# EAGLE design tx35 (EAGLE 6.5.0)
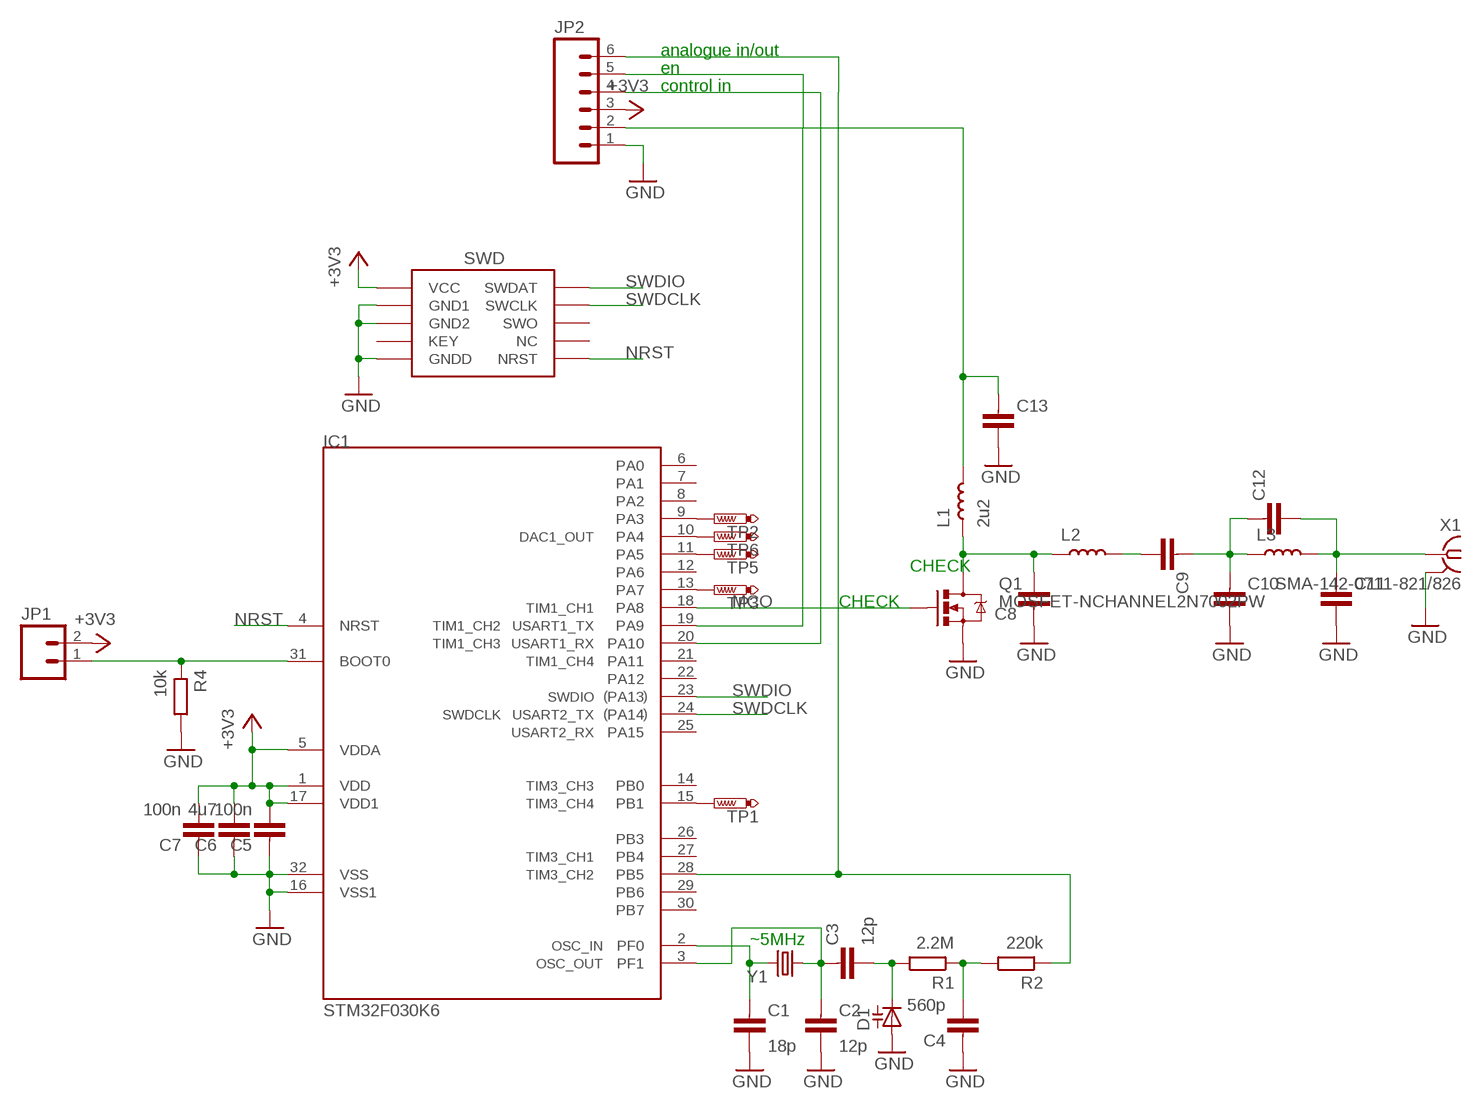
[diagram p0: schematic, sheet 1]

## Parts
C1  18p  CAPACITOR0603-N  [C0603-N]
C2  12p  CAPACITOR0603-N  [C0603-N]
C3  12p  CAPACITOR0603-N  [C0603-N]
C4  560p  CAPACITOR0603-N  [C0603-N]
C5  100n  CAPACITOR0603-N  [C0603-N]
C6  4u7  CAPACITOR0603-N  [C0603-N]
C7  100n  CAPACITOR0603-N  [C0603-N]
C8  CAPACITOR0603-N  [C0603-N]
C9  CAPACITOR0603-N  [C0603-N]
C10  CAPACITOR0603-N  [C0603-N]
C11  CAPACITOR0603-N  [C0603-N]
C12  CAPACITOR0603-N  [C0603-N]
C13  CAPACITOR0805-N  [C0805-N]
D1  DIODE_CAPACITANCE-SOD523  [SOD523]
IC1  STM32F030K6  STM32F0-32  [TQFP32-08]
J1  SWD_SHROUD  [SWD_PTH_SHROUD]
JP1  M02PTH  [1X02]
JP2  M06SILK_FEMALE_PTH  [1X06]
L1  2u2  INDUCTOR0603-N  [L0603-N]
L2  INDUCTOR0603-N  [L0603-N]
L3  INDUCTOR0603-N  [L0603-N]
Q1  MOSFET-NCHANNEL2N7002PW  [SOT323]
R1  2.2M  RESISTOR0603-N  [R0603-N]
R2  220k  RESISTOR0603-N  [R0603-N]
R4  10k  RESISTOR0603-N  [R0603-N]
TP1  PTR1TP11R  [TP11R]
TP2  PTR1TP11R  [TP11R]
TP3  PTR1TP11R  [TP11R]
TP5  PTR1TP11R  [TP11R]
TP6  PTR1TP11R  [TP11R]
X1  SMA-142-0711-821/826  [J502-ND-142-0711-821/826]
Y1  CRYSTALHC49UV  [HC49U-V]

## Nets
+3V3: C5.2 C6.2 C7.2 IC1.1(VDD) IC1.5(VDDA) IC1.17(VDD1) J1.1(VCC) JP1.2 JP2.3
GND: C1.2 C2.2 C4.1 C5.1 C6.1 C7.1 C8.1 C10.2 C11.2 C13.2 D1.A IC1.16(VSS1) IC1.32(VSS) J1.3(GND1) J1.5(GND2) J1.9(GNDD) JP2.1 Q1.2(S) R4.2 X1.G@1 X1.G@2 X1.G@3 X1.G@4
MCO: IC1.18(PA8) Q1.1(G)
N$1: C2.1 C3.1 IC1.3(PF1) Y1.1
N$2: C1.1 IC1.2(PF0) Y1.2
N$3: C3.2 D1.C R1.2
N$4: C4.2 R1.1 R2.2
N$5: IC1.28(PB5) JP2.6 R2.1
N$6: C11.1 C12.2 L3.2 X1.1
N$7: C13.1 JP2.2 L1.2
N$8: C9.1 C10.1 C12.1 L3.1
N$9: IC1.20(PA10) JP2.4
N$10: C9.2 L2.2
N$11: C8.2 L1.1 L2.1 Q1.3(D)
N$12: IC1.19(PA9) JP2.5
N$13: IC1.31(BOOT0) JP1.1 R4.1
N$14: IC1.9(PA3) TP2.TP
N$15: IC1.15(PB1) TP1.TP
N$16: IC1.13(PA7) TP3.TP
N$18: IC1.11(PA5) TP5.TP
N$19: IC1.10(PA4) TP6.TP
NRST: IC1.4(NRST) J1.10(NRST)
SWDCLK: IC1.24(PA14) J1.4(SWCLK)
SWDIO: IC1.23(PA13) J1.2(SWDAT)
Unconnected: IC1.6(PA0) IC1.7(PA1) IC1.8(PA2) IC1.12(PA6) IC1.14(PB0) IC1.21(PA11) IC1.22(PA12) IC1.25(PA15) IC1.26(PB3) IC1.27(PB4) IC1.29(PB6) IC1.30(PB7) J1.6(SWO) J1.7(KEY) J1.8(NC)

## Notes on the sheet
- analogue in/out
- en
- control in
- CHECK
- CHECK
- ~5MHz

## Library data of the parts
C1-C7 C9-C13 = passives-7351:CAPACITOR
C8 = passives-7351:CAPACITOR; FARNELL: 2434613/2435457
D1 = diode:DIODE_CAPACITANCE-: Capacity DIODE; FARNELL: 1757783/(2443453)
IC1 = Mine:STM32F0-32; FARNELL: 2432085
J1 = dtb:SWD_SHROUD
JP1 = Mine:M02: Header 2 Standard 2-pin 0.1" header. Use with straight break away headers (SKU : PRT-00116), right angle break away headers (PRT-00553), swiss pins (PRT-00743), machine pins (PRT-00117), and female headers (PRT-00115). Molex polarized connector foot print use with SKU : PRT-08233 with associated crimp pins and housings.
JP2 = SparkFun-Connectors:M06: Header 6 Standard 6-pin 0.1" header. Use with straight break away headers (SKU : PRT-00116), right angle break away headers (PRT-00553), swiss pins (PRT-00743), machine pins (PRT-00117), and female headers (PRT-00115). Molex polarized connector foot print use with SKU : PRT-08094 with associated crimp pins and housings. NOTES ON THE VARIANTS LOCK and LOCK_LONGPADS... This footprint was designed to help hold the alignment of a through-hole component (i.e. 6-pin header) while soldering it into place. You may notice that each hole has been shifted either up or down by 0.005 of an inch from it's more standard position (which is a perfectly straight line). This slight alteration caused the pins (the squares in the middle) to touch the edges of the holes. Because they are alternating, it causes a "brace" to hold the component in place. 0.005 has proven to be the perfect amount of "off-center" position when using our standard breakaway headers. Although looks a little odd when you look at the bare footprint, once you have a header in there, the alteration is very hard to notice. Also,if you push a header all the way into place, it is covered up entirely on the bottom side. This idea of altering the position of holes to aid alignment will be further integrated into the Sparkfun Library for other footprints. It can help hold any component with 3 or more connection pins.; PROD_ID: CONN-08437
L1 = passives-7351:INDUCTOR; FARNELL: 2215642
L2 = passives-7351:INDUCTOR; FARNELL: 1669538/(1711879)
L3 = passives-7351:INDUCTOR
Q1 = SparkFun-DiscreteSemi:MOSFET-NCHANNEL: Common NMOSFET Parts MFG P/N Store ID Prod ID FDD8780 TRANS-09984 SI7820DN TRANS-11055 FDS6630A IC-08089 2N7002PW TRANS-11151 FQP30N06L COM-10213 TRANS-10060 BSS123LT1G TRANS-08345 BSS138 TRANS-00830 BS170 2N7000; FARNELL: 1894713; PROD_ID: TRANS-11151
R1 R2 R4 = passives-7351:RESISTOR
TP1-TP3 TP5 TP6 = testpad:PTR1: TEST PIN
X1 = con-coax:SMA-: SMA 50 Ohm End Launch Jack Receptacle - Round Contact Johnson Components Source: www.johnsoncomponents.com .. J502-ND.pdf; MF: JOHNSON COMPONENTS; MPN: 142-0711-821; OC_FARNELL: 1019328; OC_NEWARK: 16F3627
Y1 = SparkFun-FreqCtrl:CRYSTAL: Various standard crystals. Proven footprints.; FARNELL: 1666962/(1652566)

## Board
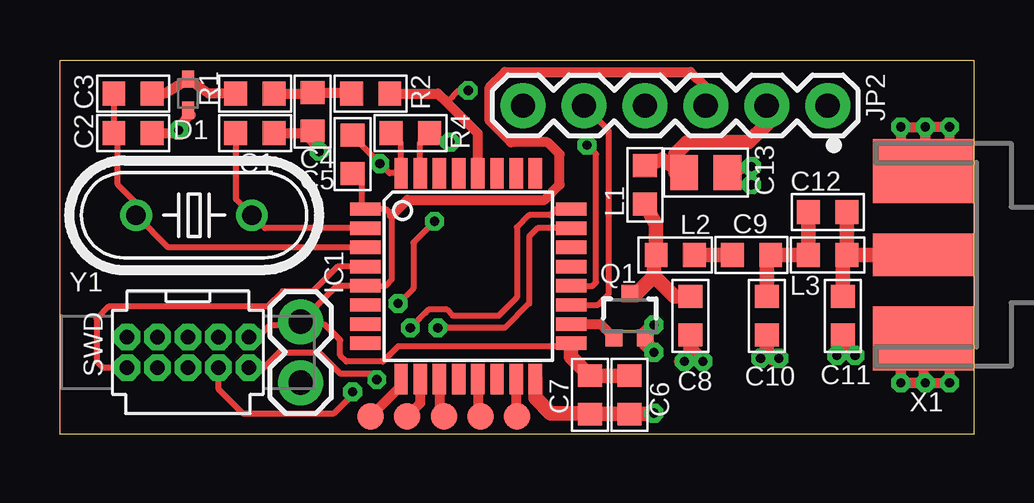
[diagram p1: board, top side]
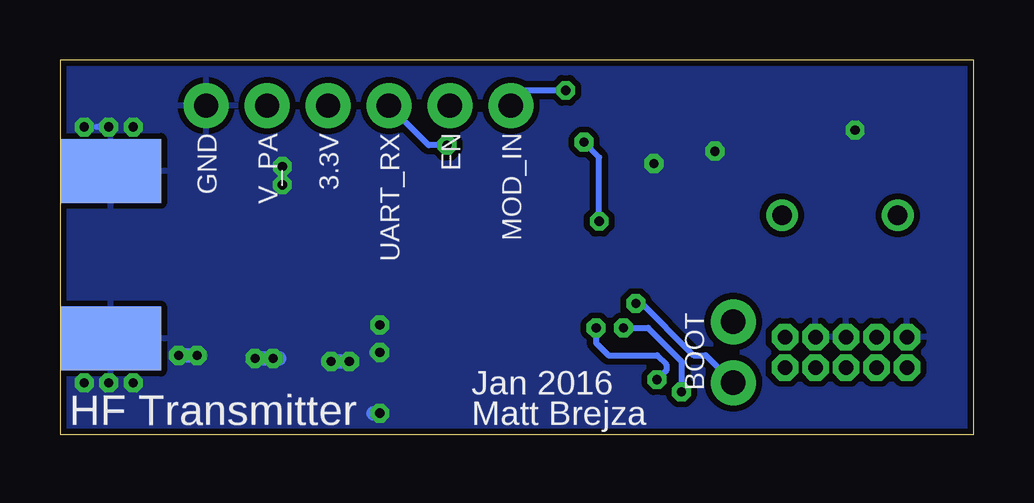
[diagram p2: board, bottom side, seen from below]

Size 38.1 x 15.62 mm. Coordinates in mm from the lower left corner, seen from the top.
Outline: 0,15.62 38.1,15.62 38.1,0 0,0 0,15.62
Copper layers (1*16): Top 0.035mm / dielectric 1.5mm / Bottom 0.035mm
Design rules "default *": minimum track width 10mil, minimum drill 14mil, track to track 8mil, track to pad 8mil, pad to pad 6mil, via to via 8mil, smd to smd 8mil, copper to edge 10mil, drill to drill 8mil, minimum pad ring 10mil, minimum via ring 8mil, stop-mask expansion 4mil, vias tented up to drill 16mil, thermal gap 10mil

### Footprints (pad centres in the part's own frame; a part is rotated, then mirrored left to right if it is on the bottom)
C0603-N = smd 0.95 x 1: 1 -0.8,0; 2 0.8,0
C0805-N = smd 1.15 x 1.45: 1 -0.9,0; 2 0.9,0
SOD523 = smd 0.7 x 0.5: A 0.7,0; C -0.6,0
TQFP32-08 = smd 1.27 x 0.559: 1 -4.293,2.8; 2 -4.293,2; 3 -4.293,1.2; 4 -4.293,0.4; 5 -4.293,-0.4; 6 -4.293,-1.2; 7 -4.293,-2; 8 -4.293,-2.8; 17 4.293,-2.8; 18 4.293,-2; 19 4.293,-1.2; 20 4.293,-0.4; 21 4.293,0.4; 22 4.293,1.2; 23 4.293,2; 24 4.293,2.8 | smd 0.559 x 1.27: 9 -2.8,-4.293; 10 -2,-4.293; 11 -1.2,-4.293; 12 -0.4,-4.293; 13 0.4,-4.293; 14 1.2,-4.293; 15 2,-4.293; 16 2.8,-4.293; 25 2.8,4.293; 26 2,4.293; 27 1.2,4.293; 28 0.4,4.293; 29 -0.4,4.293; 30 -1.2,4.293; 31 -2,4.293; 32 -2.8,4.293
SWD_PTH_SHROUD = drill 0.6 octagon: 1 -2.54,-0.635; 2 -2.54,0.635; 3 -1.27,-0.635; 4 -1.27,0.635; 5 0,-0.635; 6 0,0.635; 7 1.27,-0.635; 8 1.27,0.635; 9 2.54,-0.635; 10 2.54,0.635
1X02 = drill 1.016 pad 1.88: 1 0,0; 2 2.54,0
1X06 = drill 1.016 pad 1.88: 1 0,0; 2 2.54,0; 3 5.08,0; 4 7.62,0; 5 10.16,0; 6 12.7,0
L0603-N = smd 0.95 x 1: 1 -0.8,0; 2 0.8,0
SOT323 = smd 0.7 x 0.7: 1 -0.65,-0.925; 2 0.65,-0.925; 3 0,0.925
R0603-N = smd 0.95 x 1: 1 -0.8,0; 2 0.8,0
TP11R = smd 1.1 x 1.1: TP 0,0
J502-ND-142-0711-821/826 = smd 4.191 x 1.778: 1 2.115,0 | smd 4.191 x 2.667: G@1 2.115,3.495; G@2 2.115,-3.495 | smd 4.191 x 2.667 bottom: G@3 2.115,3.495; G@4 2.115,-3.495
HC49U-V = drill 0.813: 1 -2.413,0; 2 2.413,0

### Placement (x,y rotation side)
C1  8.13,12.57 0 top
C2  3.05,12.57 0 top
C3  3.05,14.22 0 top
C4  10.54,13.46 90 top
C5  12.19,11.68 270 top
C6  23.75,1.65 90 top
C7  22.1,1.65 90 top
C8  26.29,4.95 90 top
C9  28.83,7.49 180 top
C10  29.46,4.95 270 top
C11  32.64,4.95 270 top
C12  32,9.27 0 top
C13  26.92,10.92 0 top
D1  5.33,14.22 270 top
IC1  17.02,6.6 0 top
J1  5.33,3.43 180 top
JP1  10.03,2.16 90 top
JP2  32,13.72 180 top
L1  24.38,10.41 90 top
L2  25.65,7.49 0 top
L3  32,7.49 0 top
Q1  23.75,4.95 0 top
R1  8.13,14.22 180 top
R2  12.95,14.22 180 top
R4  14.6,12.57 180 top
TP1  19.05,0.76 0 top
TP2  12.95,0.76 0 top
TP3  17.53,0.76 0 top
TP5  16,0.76 0 top
TP6  14.48,0.76 0 top
X1  38.1,7.49 180 top
Y1  5.59,9.14 0 top

### Tracks (layer width: path | path; a pad name or v marks a point on that pad's centre or on a via)
+3V3
  Top 0.254: C5.2 12.1,10.88 12.57,10.41 12.57,9.56 IC1.1 13.59,9.4 13.84,9.14 13.84,6.48 13.57,6.2 IC1.5 11.54,6.2 JP1.2 | IC1.17 21.08,3.8 20.96,3.68 14.1,3.68 13.46,3.05 11.94,3.05 11.68,3.3 11.68,3.94 11.05,4.57 10.16,4.57 JP1.2 | J1.1 8.26,4.06 8.76,4.57 9.91,4.57 JP1.2
  Top 0.406: 13.84,9.14 14.48,9.78 20.19,9.78 20.83,10.41 20.83,11.68 20.32,12.19 18.8,12.19 17.91,13.08 17.91,14.48 18.54,15.11 26.29,15.11 26.92,14.48 JP2.3
  Top 0.61: IC1.17 21.31,3.24 C7.2 C6.2
GND  (via drill 0.38)
  Top 0.254: D1.A 5.46,13.33 | 10.29,12.32 v10.79,11.81 10.54,12.07 C4.1 | C5.1 12.19,12.45 v13.33,11.3 13.74,10.9 IC1.32 14.22,12.16 R4.2 | X1.G@4 35.98,12.74 v36.07,12.83 | C13.2 28.32,10.92 v28.83,11.18 | v28.83,10.41 28.32,10.41 27.94,10.8
  Top 0.406: C2.2 5.08,12.57 v4.95,12.7 5.33,13.33 5.46,13.33 | C1.2 10.45,12.57 C4.1 | v35.05,2.16 v36.07,2.16 35.98,2.24 X1.G@1 35.05,3.07 v35.05,2.16 | v35.05,2.16 v37.08,2.16 37.08,3.17 35.31,3.17 35.05,2.92 v35.05,2.16 | 36.07,11.94 35.05,11.94 v35.05,12.83 v36.07,12.83 | 36.07,11.94 37.08,11.94 v37.08,12.83 v36.07,12.83 | v36.07,12.83 36.07,11.94
  Top 0.61: C10.2 29.46,3.3 29.34,3.3 v29.21,3.17 | v29.97,3.17 29.72,3.17 | C11.2 32.64,3.56 v32.39,3.3 | v33.15,3.3 33.02,3.3 | C8.1 26.29,3.56 v26.8,3.05 | v26.04,3.05 25.91,3.05 | v24.77,3.43 24.4,3.79 Q1.2 24.4,4.21 v24.77,4.57 | IC1.16 19.82,1.52 20.45,0.89 22.06,0.89 C7.1 C6.1 24.73,0.85 v24.77,0.89
  Bottom 0.254: v4.95,12.7 5.21,12.83 5.08,12.95 | v10.79,11.81 10.92,11.81 | v13.33,11.3 13.33,11.05 | v36.07,12.83 36.58,12.83 | v28.83,11.18 v28.83,10.41
  Bottom 0.61: 28.96,3.17 v29.21,3.17 v29.97,3.17 | 32.26,3.3 v32.39,3.3 v33.15,3.3 | 26.92,3.05 v26.8,3.05 v26.04,3.05 | v24.77,3.43 24.89,3.43 | v24.77,0.89 25.02,0.89
  pour Bottom (isolate 0.254): -0.13,16.26 39.5,16.26 39.75,16 39.75,-0.38 39.37,-0.76 -0.25,-0.76 -0.63,-0.38 -0.63,15.62 -0.51,15.75
MCO
  Top 0.406: IC1.18 22.52,4.6 Q1.1
N$1
  Top 0.254: IC1.3 4.52,7.8 Y1.1 3.18,9.65 2.41,10.41 2.41,12.15 C2.1 C3.1
N$2
  Top 0.254: IC1.2 8.54,8.6 Y1.2 7.33,9.82 C1.1
N$3
  Top 0.406: R1.2 6.19,14.22 D1.C 4.35,14.22 C3.2
N$4
  Top 0.406: R1.1 10.5,14.22 C4.2 12.12,14.26 R2.2
N$5  (via drill 0.38)
  Top 0.254: v17.02,14.35 16.64,14.35 16.13,13.84
  Top 0.406: R2.1 15.75,14.22 16.13,13.84 17.42,12.55 IC1.28
  Bottom 0.254: JP2.6 19.3,13.97 18.92,14.35 v17.02,14.35
N$6
  Top 0.61: C12.2 L3.2 | X1.1 L3.2 | C11.1 32.64,7.33 L3.2
N$7
  Top 0.61: L1.2 25.1,11.47 C13.1 25.65,10.93 25.65,11.68 26.16,12.19 28.7,12.19 29.46,12.95 JP2.2
N$8
  Top 0.61: C12.1 L3.1 C9.1 29.46,7.33 C10.1
N$9  (via drill 0.38)
  Top 0.254: IC1.20 22.21,6.2 22.35,6.35 22.35,11.68 v21.97,12.07
  Bottom 0.254: v21.97,12.07 22.73,12.07 JP2.4
N$10
  Top 0.61: L2.2 C9.2
N$11
  Top 0.61: C8.2 25.62,5.75 24.77,6.6 | 24.77,6.6 24.77,7.4 L2.1 24.85,8.76 L1.1 | Q1.3 24.04,5.88 24.77,6.6
N$12
  Top 0.254: IC1.19 22.42,5.4 22.86,5.84 22.86,12.7 JP2.5
N$13  (via drill 0.38)
  Top 0.254: IC1.31 15.02,12.19 R4.1 15.79,12.19 v16.26,12.19 | v14.1,5.46 14.73,6.1 14.73,8 v15.62,8.89
  Bottom 0.254: v14.1,5.46 13.97,5.59 11.68,3.3 11.18,3.3 JP1.1 | v15.62,8.89 15.62,11.56 v16.26,12.19
N$14
  Top 0.406: IC1.9 14.22,2.03 TP2.TP
N$15
  Top 0.406: IC1.15 19.02,0.79 TP1.TP
N$16
  Top 0.406: IC1.13 17.42,0.87 TP3.TP
N$18
  Top 0.406: IC1.11 15.82,0.95 TP5.TP
N$19
  Top 0.406: IC1.10 15.02,1.3 TP6.TP
NRST
  Top 0.254: IC1.4 11.58,7 10.54,5.97 9.27,5.97 8.64,5.33 2.03,5.33 1.52,4.83 1.52,3.05 1.78,2.79 J1.10
SWDCLK  (via drill 0.38)
  Top 0.254: 15.24,5.08 v14.6,4.44 15.37,5.21 16.13,5.21 16.38,4.95 18.29,4.95 19.05,5.72 19.05,8.64 19.56,9.14 20.45,9.14 20.71,9.4 IC1.24 | v12.19,1.78 12.19,1.65 11.43,0.89 7.62,0.89 6.6,1.91 J1.4
  Bottom 0.254: v14.6,4.44 13.59,4.44 12.19,3.05 v12.19,1.78
SWDIO  (via drill 0.38)
  Top 0.254: 15.88,4.57 v15.75,4.44 | 15.62,4.32 v15.75,4.44 | J1.2 8.51,2.79 9.14,3.43 10.79,3.43 11.68,2.54 12.95,2.54 v13.21,2.29 | v15.75,4.44 18.54,4.44 19.56,5.46 19.56,8.25 19.91,8.6 IC1.23
  Bottom 0.254: v15.75,4.44 15.75,3.81 15.24,3.3 13.21,3.3 12.83,2.92 12.83,2.67 v13.21,2.29

### Text on the board
tPlace: SWD
bPlace: MOD_IN | EN | UART_RX | 3.3V | V_PA | GND | BOOT | Jan 2016 | Matt Brejza | HF Transmitter